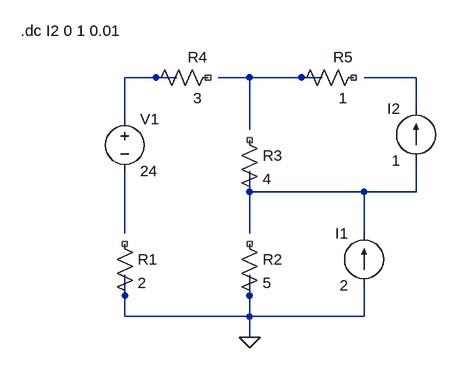
[diagram p0: schematic Ex_04_77.asc]
Ex_04_77.asc, the LTspice schematic file:
Version 4.1
SHEET 1 880 680
WIRE 96 32 16 32
WIRE 208 32 160 32
WIRE 320 32 208 32
WIRE 464 32 384 32
WIRE 464 80 464 32
WIRE 16 96 16 32
WIRE 208 112 208 32
WIRE 208 208 208 176
WIRE 384 208 208 208
WIRE 464 208 464 160
WIRE 464 208 384 208
WIRE 16 272 16 176
WIRE 208 272 208 208
WIRE 384 272 384 208
WIRE 16 400 16 336
WIRE 208 400 208 336
WIRE 208 400 16 400
WIRE 384 400 384 352
WIRE 384 400 208 400
WIRE 208 432 208 400
FLAG 208 432 0
SYMBOL voltage 16 80 R0
WINDOW 123 0 0 Left 0
WINDOW 39 0 0 Left 0
SYMATTR InstName V1
SYMATTR Value 24
SYMBOL current 384 352 R180
WINDOW 0 24 80 Left 2
WINDOW 3 24 0 Left 2
WINDOW 123 0 0 Left 0
WINDOW 39 0 0 Left 0
SYMATTR InstName I1
SYMATTR Value 2
SYMBOL res 0 272 R0
SYMATTR InstName R1
SYMATTR Value 2
SYMBOL res 192 272 R0
SYMATTR InstName R2
SYMATTR Value 5
SYMBOL res 192 112 R0
SYMATTR InstName R3
SYMATTR Value 4
SYMBOL res 160 16 R90
WINDOW 0 0 32 VBottom 2
WINDOW 3 32 32 VTop 2
SYMATTR InstName R4
SYMATTR Value 3
SYMBOL res 384 16 R90
WINDOW 0 0 32 VBottom 2
WINDOW 3 32 32 VTop 2
SYMATTR InstName R5
SYMATTR Value 1
SYMBOL current 464 160 R180
WINDOW 0 24 80 Left 2
WINDOW 3 24 0 Left 2
WINDOW 123 0 0 Left 0
WINDOW 39 0 0 Left 0
SYMATTR InstName I2
SYMATTR Value 1
TEXT -144 -40 Left 2 !.dc I2 0 1 0.01

The netlist it stands for:
* Ex_04_77.asc
V1 N001 N005 24
I1 0 N004 2
R1 NC_01 0 2
R2 NC_02 0 5
R3 NC_03 N004 4
R4 NC_04 N001 3
R5 NC_05 N002 1
I2 N004 N003 1
.dc I2 0 1 0.01
.backanno
.end